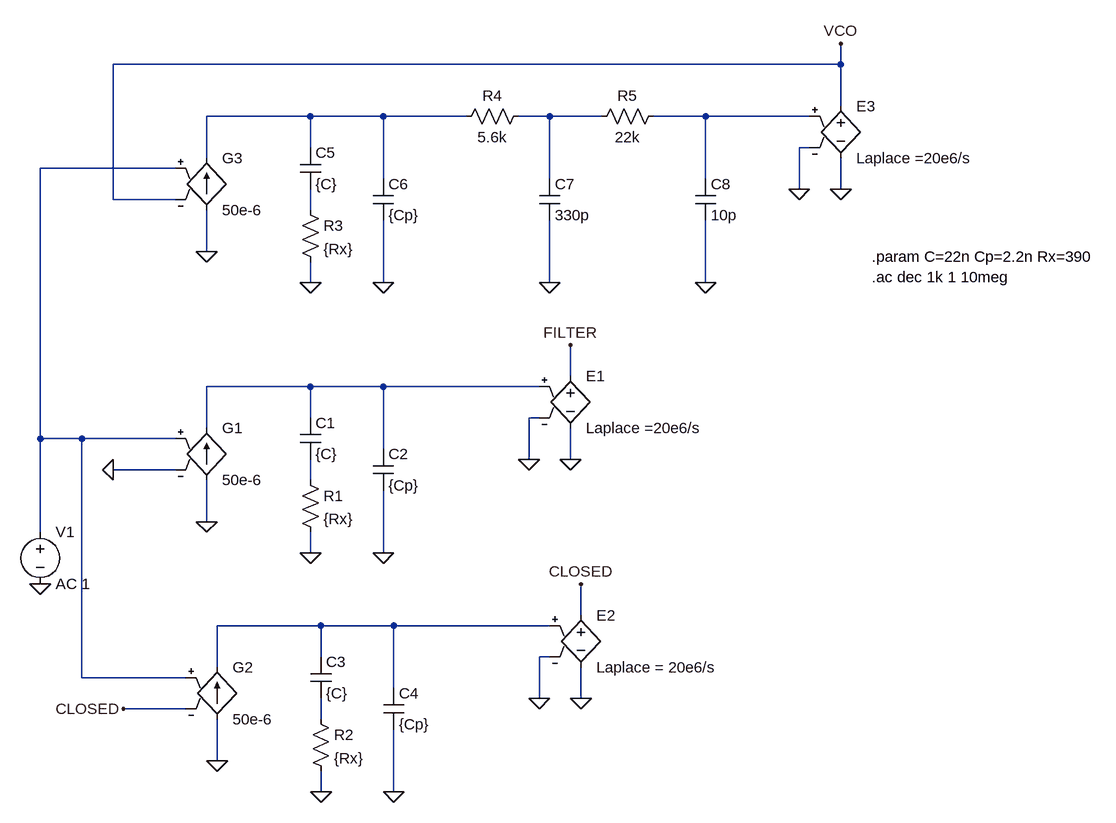
[diagram p0: schematic PLL_ behavioural.asc]
PLL_ behavioural.asc, the LTspice schematic file:
Version 4
SHEET 1 1752 864
WIRE 1360 -272 1360 -304
WIRE 1360 -272 240 -272
WIRE 1360 -208 1360 -272
WIRE 544 -192 384 -192
WIRE 656 -192 544 -192
WIRE 784 -192 656 -192
WIRE 912 -192 864 -192
WIRE 992 -192 912 -192
WIRE 1152 -192 1072 -192
WIRE 1312 -192 1152 -192
WIRE 544 -144 544 -192
WIRE 1312 -144 1296 -144
WIRE 384 -128 384 -192
WIRE 336 -112 128 -112
WIRE 656 -96 656 -192
WIRE 912 -96 912 -192
WIRE 1152 -96 1152 -192
WIRE 1296 -80 1296 -144
WIRE 1360 -80 1360 -128
WIRE 240 -64 240 -272
WIRE 336 -64 240 -64
WIRE 544 -48 544 -80
WIRE 384 16 384 -48
WIRE 544 64 544 32
WIRE 656 64 656 -32
WIRE 912 64 912 -32
WIRE 1152 64 1152 -32
WIRE 944 208 944 160
WIRE 544 224 384 224
WIRE 656 224 544 224
WIRE 896 224 656 224
WIRE 544 272 544 224
WIRE 896 272 880 272
WIRE 384 288 384 224
WIRE 128 304 128 -112
WIRE 192 304 128 304
WIRE 336 304 192 304
WIRE 656 320 656 224
WIRE 880 336 880 272
WIRE 944 336 944 288
WIRE 336 352 240 352
WIRE 544 368 544 336
WIRE 384 432 384 368
WIRE 128 448 128 304
WIRE 544 480 544 448
WIRE 656 480 656 384
WIRE 960 576 960 528
WIRE 560 592 400 592
WIRE 672 592 560 592
WIRE 912 592 672 592
WIRE 560 640 560 592
WIRE 912 640 896 640
WIRE 400 656 400 592
WIRE 192 672 192 304
WIRE 352 672 192 672
WIRE 672 688 672 592
WIRE 896 704 896 640
WIRE 960 704 960 656
WIRE 352 720 256 720
WIRE 560 736 560 704
WIRE 400 800 400 736
WIRE 560 848 560 816
WIRE 672 848 672 752
FLAG 544 480 0
FLAG 656 480 0
FLAG 880 336 0
FLAG 944 336 0
FLAG 560 848 0
FLAG 672 848 0
FLAG 896 704 0
FLAG 960 704 0
FLAG 544 64 0
FLAG 656 64 0
FLAG 1296 -80 0
FLAG 1360 -80 0
FLAG 912 64 0
FLAG 1152 64 0
FLAG 240 352 0
FLAG 128 528 0
FLAG 944 160 FILTER
FLAG 1360 -304 VCO
FLAG 960 528 CLOSED
FLAG 256 720 CLOSED
FLAG 400 800 0
FLAG 384 432 0
FLAG 384 16 0
SYMBOL g 384 272 R0
SYMATTR InstName G1
SYMATTR Value 50e-6
SYMBOL e 944 192 R0
SYMATTR InstName E1
SYMATTR Value Laplace =20e6/s
SYMBOL Cap 528 272 R0
SYMATTR InstName C1
SYMATTR Value {C}
SYMBOL Cap 640 320 R0
SYMATTR InstName C2
SYMATTR Value {Cp}
SYMBOL Res 528 352 R0
SYMATTR InstName R1
SYMATTR Value {Rx}
SYMBOL g 400 640 R0
SYMATTR InstName G2
SYMATTR Value 50e-6
SYMBOL e 960 560 R0
SYMATTR InstName E2
SYMATTR Value Laplace = 20e6/s
SYMBOL Cap 544 640 R0
SYMATTR InstName C3
SYMATTR Value {C}
SYMBOL Cap 656 688 R0
SYMATTR InstName C4
SYMATTR Value {Cp}
SYMBOL Res 544 720 R0
SYMATTR InstName R2
SYMATTR Value {Rx}
SYMBOL g 384 -144 R0
SYMATTR InstName G3
SYMATTR Value 50e-6
SYMBOL e 1360 -224 R0
SYMATTR InstName E3
SYMATTR Value Laplace =20e6/s
SYMBOL Cap 528 -144 R0
SYMATTR InstName C5
SYMATTR Value {C}
SYMBOL Cap 640 -96 R0
SYMATTR InstName C6
SYMATTR Value {Cp}
SYMBOL Res 528 -64 R0
SYMATTR InstName R3
SYMATTR Value {Rx}
SYMBOL Res 880 -208 R90
WINDOW 0 0 56 VBottom 2
WINDOW 3 32 56 VTop 2
SYMATTR InstName R4
SYMATTR Value 5.6k
SYMBOL Res 1088 -208 R90
WINDOW 0 0 56 VBottom 2
WINDOW 3 32 56 VTop 2
SYMATTR InstName R5
SYMATTR Value 22k
SYMBOL Cap 896 -96 R0
SYMATTR InstName C7
SYMATTR Value 330p
SYMBOL Cap 1136 -96 R0
SYMATTR InstName C8
SYMATTR Value 10p
SYMBOL Voltage 128 432 R0
SYMATTR InstName V1
SYMATTR Value AC 1
TEXT 1408 24 Left 2 !.param C=22n Cp=2.2n Rx=390\n.ac dec 1k 1 10meg
�

The netlist it stands for:
* PLL_ behavioural.asc
G1 0 N006 N004 0 50e-6
E1 FILTER 0 N006 0 Laplace =20e6/s
C1 N006 N007 {C}
C2 N006 0 {Cp}
R1 N007 0 {Rx}
G2 0 N008 N004 CLOSED 50e-6
E2 CLOSED 0 N008 0 Laplace = 20e6/s
C3 N008 N009 {C}
C4 N008 0 {Cp}
R2 N009 0 {Rx}
G3 0 N001 N004 VCO 50e-6
E3 VCO 0 N003 0 Laplace =20e6/s
C5 N001 N005 {C}
C6 N001 0 {Cp}
R3 N005 0 {Rx}
R4 N002 N001 5.6k
R5 N003 N002 22k
C7 N002 0 330p
C8 N003 0 10p
V1 N004 0 AC 1
.param C=22n Cp=2.2n Rx=390
.ac dec 1k 1 10meg
.backanno
.end